# EAGLE design Adafruit Feather nRF52840 Sense Rev C (EAGLE 9.6.2)
COMPANY: ADAFRUIT INDUSTRIES; DRAWN: KTOWN; REV: D; YEAR: 2018
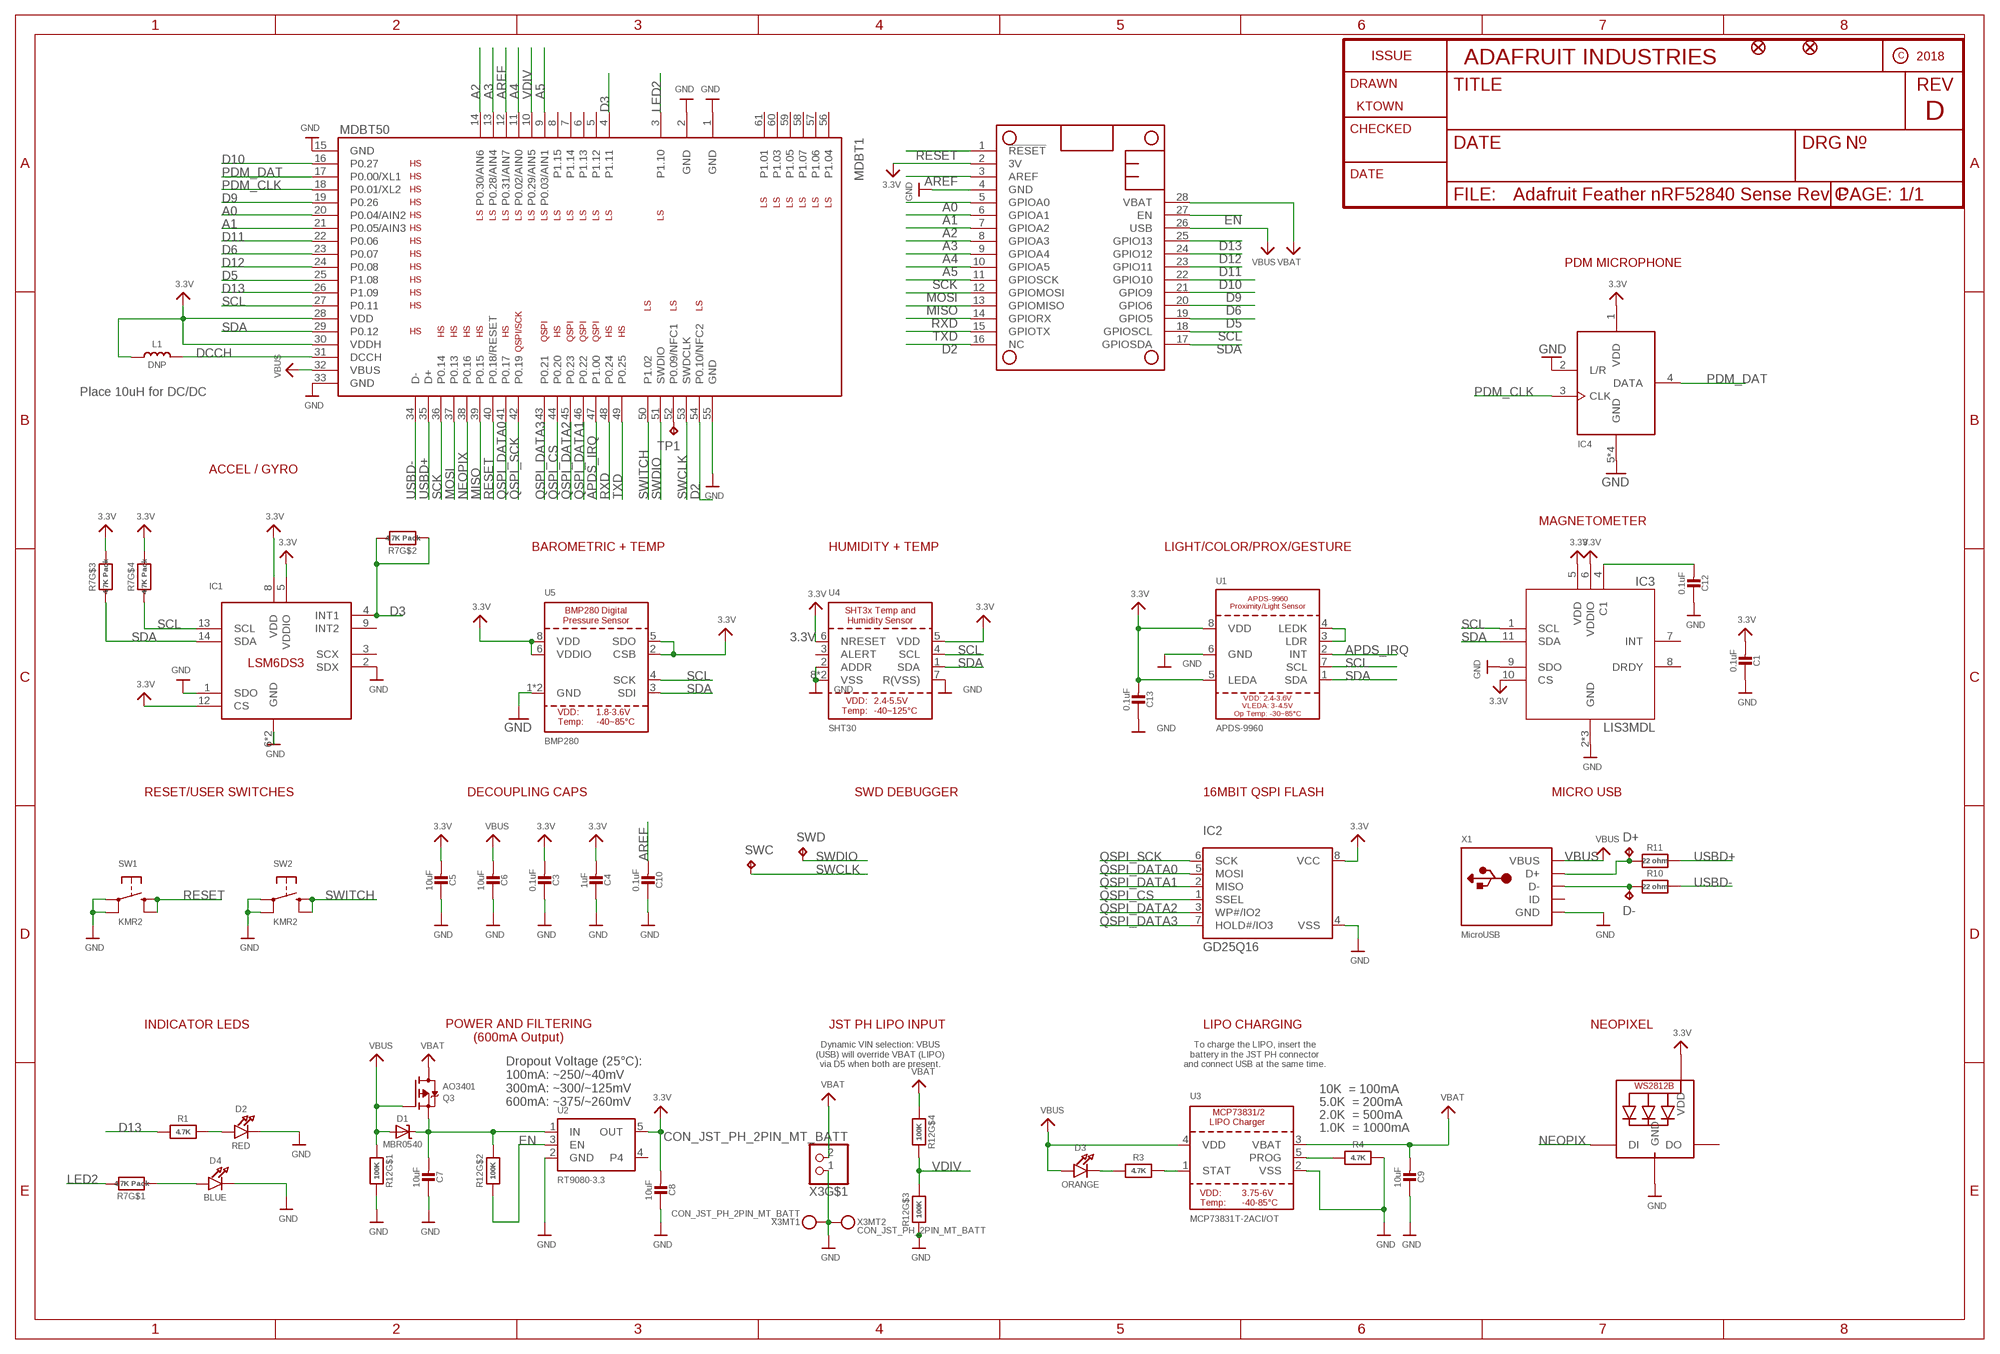
[diagram p0: schematic, sheet 1]

## Parts
C1  0.1uF  CAP_CERAMIC0603_NO  [0603-NO]
C3  0.1uF  CAP_CERAMIC0603_NO  [0603-NO]
C4  1uF  CAP_CERAMIC0603_NO  [0603-NO]
C5  10uF  CAP_CERAMIC0805-NOOUTLINE  [0805-NO]
C6  10uF  CAP_CERAMIC0805-NOOUTLINE  [0805-NO]
C7  10uF  CAP_CERAMIC0805-NOOUTLINE  [0805-NO]
C8  10uF  CAP_CERAMIC0805-NOOUTLINE  [0805-NO]
C9  10uF  CAP_CERAMIC0805-NOOUTLINE  [0805-NO]
C10  0.1uF  CAP_CERAMIC0603_NO  [0603-NO]
C12  0.1uF  CAP_CERAMIC0603_NO  [0603-NO]
C13  0.1uF  CAP_CERAMIC0603_NO  [0603-NO]
D1  MBR0540  DIODE-SCHOTTKYSOD-123  [SOD-123]
D2  RED  LED0603_NOOUTLINE  [CHIPLED_0603_NOOUTLINE]
D3  ORANGE  LED0603_NOOUTLINE  [CHIPLED_0603_NOOUTLINE]
D4  BLUE  LED0603_NOOUTLINE  [CHIPLED_0603_NOOUTLINE]
D+  TPTP10R  [TP10R]
D-  TPTP10R  [TP10R]
FID1  FIDUCIAL_1MM  [FIDUCIAL_1MM]
FID2  FIDUCIAL_1MM  [FIDUCIAL_1MM]
IC1  LSM6DS3  [LGA-14L]
IC2  GD25Q16  SPIFLASH_8PINUX  [USON8]
IC3  LIS3MDL  [LGA12_2X2MM]
IC4  MIC_PDM  MIC_PDM_SPK0415  [SPK0415HM4H]
L1  DNP  INDUCTOR_0805MP  [_0805MP]
LED1  WS2812B_3535FULL  [LED3535_FULLPADS]
MDBT1  MDBT50  [MDBT50]
MS1  FEATHERWING_NODIM  [FEATHERWING_NODIM]
Q3  AO3401  MOSFET-P  [SOT23-R]
R1  4.7K  RESISTOR_0603_NOOUT  [0603-NO]
R3  4.7K  RESISTOR_0603_NOOUT  [0603-NO]
R4  4.7K  RESISTOR_0603_NOOUT  [0603-NO]
R7  4.7K Pack  RESISTOR_4PACK  [RESPACK_4X0603]
R10  22 ohm  RESISTOR_0603_NOOUT  [0603-NO]
R11  22 ohm  RESISTOR_0603_NOOUT  [0603-NO]
R12  100K  RESISTOR_4PACK  [RESPACK_4X0603]
SW1  KMR2  SWITCH_TACT_SMT_RKB2  [BTN_RKB2_4.6X2.8]
SW2  KMR2  SWITCH_TACT_SMT_RKB2  [BTN_RKB2_4.6X2.8]
SWC  TPTP12R  [TP12R]
SWD  TPTP12R  [TP12R]
TP1  TPTP10R  [TP10R]
U1  APDS-9960  [APDS-9960]
U2  RT9080-3.3  VREG_SOT23-5  [SOT23-5]
U3  MCP73831T-2ACI/OT  MCP73831/2  [SOT23-5]
U4  SHT30  SHT3X  [SHT3X]
U5  BMP280  [BMP280]
X1  MicroUSB  USB_MICRO_20329_V2  [4UCONN_20329_V2]
X3  CON_JST_PH_2PIN_MT_BATT  [JSTPH2_BATT]

## Nets
3.3V [power]: C1.2 C3.2 C4.2 C5.2 C8.2 C13.2 IC1.5(VDDIO) IC1.8(VDD) IC1.12(CS) IC2.8(VCC) IC3.5(VDD) IC3.6(VDDIO) IC3.10(CS) IC4.1(VDD) L1.1 LED1.2(VDD) MDBT1.28(VDD) MDBT1.30(VDDH) MS1.2(3V) R7.5 R7.6 U1.5(LEDA) U1.8(VDD) U2.5(OUT) U4.5(VDD) U4.6(NRESET) U5.2(CSB) U5.5(SDO) U5.6(VDDIO) U5.8(VDD)
A0: MDBT1.20(P0.04/AIN2) MS1.5(GPIOA0)
A1: MDBT1.21(P0.05/AIN3) MS1.6(GPIOA1)
A2: MDBT1.14(P0.30/AIN6) MS1.7(GPIOA2)
A3: MDBT1.13(P0.28/AIN4) MS1.8(GPIOA3)
A4: MDBT1.11(P0.02/AIN0) MS1.9(GPIOA4)
A5: MDBT1.9(P0.03/AIN1) MS1.10(GPIOA5)
APDS_IRQ: MDBT1.47(P1.00) U1.2(INT)
AREF: C10.2 MDBT1.12(P0.31/AIN7) MS1.3(AREF)
CAP1: C12.2 IC3.4(C1)
D2: MDBT1.54(P0.10/NFC2) MS1.16(NC)
D3: IC1.4(INT1) MDBT1.4(P1.11) R7.2 R7.7
D5: MDBT1.25(P1.08) MS1.19(GPIO5)
D6: MDBT1.23(P0.07) MS1.20(GPIO6)
D9: MDBT1.19(P0.26) MS1.21(GPIO9)
D10: MDBT1.16(P0.27) MS1.22(GPIO10)
D11: MDBT1.22(P0.06) MS1.23(GPIO11)
D12: MDBT1.24(P0.08) MS1.24(GPIO12)
D13: MDBT1.26(P1.09) MS1.25(GPIO13) R1.1
D+: D+.TP R11.1 X1.D+
D-: D-.TP R10.1 X1.D-
DCCH: L1.2 MDBT1.31(DCCH)
EN: MS1.27(EN) R12.2 U2.3(EN)
GND: C1.1 C3.1 C4.1 C5.1 C6.1 C7.1 C8.1 C9.1 C10.1 C12.1 C13.1 D2.C D4.C IC1.1(SDO) IC1.2(SDX) IC1.6(GND) IC1.7(GND) IC2.4(VSS) IC3.2(GND) IC3.3(GND) IC3.9(SDO) IC3.12(GND) IC4.2(L/R) IC4.5(GND) IC4.6(GND) IC4.7(GND) IC4.8(GND) LED1.4(GND) MDBT1.1(GND) MDBT1.2(GND) MDBT1.15(GND) MDBT1.33(GND) MDBT1.55(GND) MS1.4(GND) R4.2 R12.3 R12.8 SW1.A'(P1) SW1.A(P) SW2.A'(P1) SW2.A(P) U1.6(GND) U2.2(GND) U3.2(VSS) U4.2(ADDR) U4.7(R(VSS)) U4.8(VSS) U4.THERMAL(VSS) U5.1(GND) U5.7(GND) X1.BASE@1(GND) X1.BASE@2(GND) X1.GND X1.SPRT@1(GND) X1.SPRT@2(GND) X1.SPRT@3(GND) X1.SPRT@4(GND) X3.1 X3.NC1 X3.NC2
LED2: MDBT1.3(P1.10) R7.8
MISO: MDBT1.39(P0.15) MS1.13(GPIOMISO)
MOSI: MDBT1.37(P0.13) MS1.12(GPIOMOSI)
N$1: D3.C R3.1
N$2: U1.3(LDR) U1.4(LEDK)
N$3: D4.A R7.1
N$5: D2.A R1.2
N$11: R3.2 U3.1(STAT)
N$12: R4.1 U3.5(PROG)
NEOPIX: LED1.1(DI) MDBT1.38(P0.16)
NFC2: MDBT1.52(P0.09/NFC1) TP1.TP
PDM_CLK: IC4.3(CLK) MDBT1.18(P0.01/XL2)
PDM_DAT: IC4.4(DATA) MDBT1.17(P0.00/XL1)
QSPI_CS: IC2.1(SSEL) MDBT1.44(P0.20)
QSPI_DATA0: IC2.5(MOSI) MDBT1.41(P0.17)
QSPI_DATA1: IC2.2(MISO) MDBT1.46(P0.22)
QSPI_DATA2: IC2.3(WP#/IO2) MDBT1.45(P0.23)
QSPI_DATA3: IC2.7(HOLD#/IO3) MDBT1.43(P0.21)
QSPI_SCK: IC2.6(SCK) MDBT1.42(P0.19)
RESET: MDBT1.40(P0.18/RESET) MS1.1(!RESET) SW1.B'(S1) SW1.B(S)
RXD: MDBT1.48(P0.24) MS1.14(GPIORX)
SCK: MDBT1.36(P0.14) MS1.11(GPIOSCK)
SCL: IC1.13(SCL) IC3.1(SCL) MDBT1.27(P0.11) MS1.18(GPIOSCL) R7.4 U1.7(SCL) U4.4(SCL) U5.4(SCK)
SDA: IC1.14(SDA) IC3.11(SDA) MDBT1.29(P0.12) MS1.17(GPIOSDA) R7.3 U1.1(SDA) U4.1(SDA) U5.3(SDI)
SWCLK: MDBT1.53(SWDCLK) SWC.TP
SWDIO: MDBT1.51(SWDIO) SWD.TP
SWITCH: MDBT1.50(P1.02) SW2.B'(S1) SW2.B(S)
TXD: MDBT1.49(P0.25) MS1.15(GPIOTX)
USBD+: MDBT1.35(D+) R11.2
USBD-: MDBT1.34(D-) R10.2
VBAT [power]: C9.2 MS1.28(VBAT) Q3.3(D) R12.4 U3.3(VBAT) X3.2
VBUS [power]: C6.2 D1.A D3.A MDBT1.32(VBUS) MS1.26(USB) Q3.1(G) R12.1 U3.4(VDD) X1.VBUS
VDIV: MDBT1.10(P0.29/AIN5) R12.5 R12.6
VHI [power]: C7.2 D1.C Q3.2(S) R12.7 U2.1(IN)
Unconnected: IC1.3(SCX) IC1.9(INT2) IC3.7(INT) IC3.8(DRDY) LED1.3(DO) MDBT1.5(P1.12) MDBT1.6(P1.13) MDBT1.7(P1.14) MDBT1.8(P1.15) MDBT1.56(P1.04) MDBT1.57(P1.06) MDBT1.58(P1.07) MDBT1.59(P1.05) MDBT1.60(P1.03) MDBT1.61(P1.01) U2.4 U4.3(ALERT) X1.ID

## Notes on the sheet
- PDM MICROPHONE
- Place 10uH for DC/DC
- ACCEL / GYRO
- MAGNETOMETER
- BAROMETRIC + TEMP | HUMIDITY + TEMP | LIGHT/COLOR/PROX/GESTURE
- RESET/USER SWITCHES | DECOUPLING CAPS | SWD DEBUGGER | 16MBIT QSPI FLASH | MICRO USB
- INDICATOR LEDS | JST PH LIPO INPUT | LIPO CHARGING | NEOPIXEL
- POWER AND FILTERING
  (600mA Output)
- Dynamic VIN selection: VBUS
  (USB) will override VBAT (LIPO)
  via D5 when both are present.
- To charge the LIPO, insert the
  battery in the JST PH connector
  and connect USB at the same time.
- 10K  = 100mA
- Dropout Voltage (25°C):
  100mA: ~250/~40mV
  300mA: ~300/~125mV
  600mA: ~375/~260mV
- 5.0K  = 200mA
- 2.0K  = 500mA
- 1.0K  = 1000mA

## Library data of the parts
C1 C3-C10 C12 C13 = microbuilder:CAP_CERAMIC: Ceramic Capacitors For new designs, use the packages preceded by an '_' character since they are more reliable: The following footprints should be used on most boards: _0402 - Standard footprint for regular board layouts _0603 - Standard footprint for regular board layouts _0805 - Standard footprint for regular board layouts _1206 - Standard footprint for regular board layouts For extremely tight-pitch boards where space is at a premium, the following 'micro-pitch' footprints can be used (smaller pads, no silkscreen outline, etc.): _0402MP - Micro-pitch footprint for very dense/compact boards _0603MP - Micro-pitch footprint for very dense/compact boards _0805MP - Micro-pitch footprint for very dense/compact boards _1206MP - Micro-pitch footprint for very dense/compact boards
D1 = microbuilder:DIODE-SCHOTTKY
D2-D4 = microbuilder:LED: LED 0603 - 0603 Surface Mount Package 2mA: Green LED - Low Power (3.9mcd, 2ma, 1.7Vf) - Digikey: 475-2709-2-ND Orange LED - Low Power (9.8mcd, 2ma, 1.8Vf) - Digikey: 475-1194-2-ND Red LED - Low Power (5mcd, 2ma, 1.8Vf) - Digikey: 475-1195-2-ND Yellow LED - Low Power (7mcd, 2ma, 1.8Vf) - Digikey: 475-1196-2-ND 5mA: Blue LED - Low Power (17mcd, 5ma, 2.9Vf) - Digikey: LNJ937W8CRACT-ND 0805 - 0805 Surface Mount Package 2mA: Red LED (8.8mcd, 2mA, 1.8Vf, Clear) - Low Power [Digikey: 475-2510-1-ND] Green LED (5mcd, 2mA, 1.8Vf, Clear) - Low Power [Digikey: 475-2730-1-ND] Yellow LED (11.3mcd, 2mA, 1.8Vf, Clear) - Low Power [Digikey: 475-2555-1-ND] 20mA: Red LED (104mcd, 20mA, Diffused) - LS R976 [Digikey: 475-1278-6-ND] Red LED (12mcd, 20mA, 2.0Vf, Clear) - APT2012EC [Digikey: 754-1128-1-ND] Green LED (15mcd, 20mA, 2.2Vf, Clear) - APT2012GC [Digikey: 754-1131-1-ND] Orange LED (160mcd, 20mA, 2.1Vf, Clear) - APT2012SECK [Digikey: 754-1130-1-ND] 1206 - 1206 Surface Mount Package Green LED (26mcd, 20mA, Diffused) - LG N971 [Digikey: 475-1407-6-ND] Red LED (15mcd, 20mA, Diffused) - LH N974 [Digikey: 475-1416-6-ND] Cree - Cree High-Power Surface Mount LEDs XPEBWT-L1-0000-00D50 - White 111lm 350mA 2.9Vf 6200K 110° XTEAWT-00-0000-00000LEE3 - White 114lm 350mA 2.85Vf 5000K 115° Everlight - Everlight 45-21 Series Surface Mount LEDs 45-21/QK2C-B2832AC2CB2/2T - Warm White 2000mcd 20mA 3.25Vf 3050K 120° 45-21/LK2C-B38452C4CB2/2T - Nuetral White 2000mcd 20mA 3.25Vf 4150K 120° 45-21/LK2C-B50634C6CB2/2T - Cold White 2200mcd 20mA 3.25Vf 5650K 120° PLCC2 Reverse Mount LS T77K-J1L2-1-0-2-R18-Z - Red 11.25mcd 2mA 1.8Vf 630nm 120° LO T77K-L1M2-24-Z - Orange 19.6mcd 2mA 1.8Vf 606nm 120° LY T77K-K2M1-26-Z - Yellow 15.7mcd 2mA 1.8Vf 587nm 120°; ROT: 270
D+ D- SWC SWD TP1 = testpad:TP: Test pad
FID1 FID2 = microbuilder:FIDUCIAL: Fiducial Alignment Points Various fiducial points for machine vision alignment.; BOM: EXCLUDE
IC1 = adafruit_sensor:LSM6DS3
IC2 = microbuilder:SPIFLASH_8PIN: SOIC8 SPI Flash Be careful with the size since SOIC8 flash comes in several 'widths' SOIC8 150 mil M25P16 - 16Mbit (2Mbit x 8) Serial Flash (75MHz SPI Bus), Supply: 2.7-3.6V Digikey: SOIC8 - M25P16-VMN6P-ND SOIC8 208 mil W25Q16BVSSIG - 16Mbit (2Mbit x 8) Serial Flash (104MHz SPI Bus), Supply: 2.7-3.6V Digikey: SOIC8 - W25Q16BVSSIG-ND
IC3 = adafruit_sensor:LIS3MDL: Digital output magnetic sensor. ultra-low-power, high-performance 3-axis magnetometer; ROT: 270
IC4 = microbuilder:MIC_PDM
L1 = microbuilder:INDUCTOR: Inductors 0603: 10nH Ceramic Inductor - microwire antenna/RF (Digikey: 712-1434-2-ND) 0805: 560nH Ceramic Inductor - RF (Digikey: 553-1047-1-ND) 270nH Ceramic Inductor - Q = 40@250MHz, +-5%, 1 Ohm DC Resistance (Digikey: 535-10506-2-ND) 1007 (2518 Metric) SMT: 10µH 10% 250mOhm 820mA 1007 Inductor (Digikey: 587-2189-1-ND) 22µH 10% 500mOhm 580mA 1007 Inductor (Digikey: 587-2190-1-ND) 47µH 10% 950mOhm 420mA 1007 Inductor (Digikey: 587-2191-1-ND) 47µH 5% 100mOhm 1A 1008 Inductor (Digikey: 732-1816-1-ND) 5.0x5.0mm (Taiyo Yuden NR5040 Series) 6.8µH 20% 2.3A 64mOhm Inductor (Digikey: 587-2374-2-ND) 5.0x5.0mm (TDK VLC5045 Series) 4.7µH 20% 3.3A 34mOhm Inductor (Digikey: 445-6526-1-ND) 6.8µH 20% 2.7A 46mOhm Inductor (Digikey: 445-6527-1-ND) 6.0x6.0mm (TDK VLC6045 Series) 4.7µH 20% 3.8A 27mOhm Inductor (Digikey: 445-6538-2-ND) 6.8µH 20% 3A 41mOhm Inductor (Digikey: 445-6540-1-ND) 6.2µH 30% 2.2A 45mOhm Inductor (Digikey: SRR5028-6R2YCT-ND) - Not TDK VLC6045 but footprint should match 6.0x6.0mm (TDK SLF6045 Series) 6.8uH 30% 2A 33mOhm Inductor (Digikey: 445-4572-1-ND, Mouser: 810-SLF645T6R8N2R0PF) 6.0x6.0mm (Sumida CDRH5D28 Series) 6.2uH 30% 1.8A 45mOhm Inductor (Digikey: 308-1542-1-ND) Taiyo Yuden NR3015T2R2M - 2.2uH 20% 1.5A (Digikey: 587-1648-2-ND, Mouser: 963-NR3015T2R2M) - Used with TI TPS62172 CoilCraft RFID Transponder Coil - MA5532-AE (For use with AS3935 Lightning Sensor) Taiyo Yuden NRH2412T2R2MNGH - 2.2uH 20% 1AA (Digikey: 587-3443-1-ND) - Used with TI LM3671 Vishay IHLP 1.0uH Molded Inductor - 24mOhm DCR, 5A, +/-20%, -55°C-125°C (Digikey: 541-1319-1-ND)
LED1 = microbuilder:WS2812B; ROT: 180
MDBT1 = microbuilder:MDBT50: Raytac Corporation MDBT50 Bluetooth Low Energy Module based on Noridc nRF52840 Source: Raytac datasheet
MS1 = microbuilder:FEATHERWING
Q3 = microbuilder:MOSFET-P: P-Channel Mosfet LEGEND VDS: Voltage Drain-Source ID: Drain Current RDS(ON): Drain-Source On-State Resistance VGS(TH): Gate-Source Threshold Voltage CISS: Drain-Source Input Capacitance SOT-23 Name VDS ID RDS(ON) VGS(TH) CISS Order Number IRLML5103 30V 760mA 600 mOhm -- 75pF @ 25V Digikey: IRLML5103PBFCT-ND IRLML6401 12V 4.3A 50 mOhm 950mV @ 250µA 830pF @ 10V Digikey: IRLML6401PBFTR-ND NTR0202PL 20V 400mA 800 mOhm 2.3V @ 250uA 70pF @ 5V Digikey: NTR0202PLT1GOSTR-ND NTR4101PT1G 20V 1.8A 85 mOhm 1.2V @ 250uA 675pF @ 10V Digikey: NTR4101PT1GOSCT-ND DMP2004K 20V 600mA 900 mOhm 1V @ 250uA 175pF @ 16V Digikey: DMP2004KDICT-ND PMV65XP 20V 3.9A 76 mOhm 950mV @ 1mA 725pF @ 20V Digikey: 568-2358-2-ND TO-252 Name VDS ID RDS(ON) VGS(TH) CISS Order Number AOD417 30V 25A 34 mOhm 3V @ 250µA 920pF @ 15V Digikey: 785-1106-2-ND PowerPak Name VDS ID RDS(ON) VGS(TH) CISS Order Number AON7401 30V 12A 14 mOhm 3V @ 250µA 2600pF @ 15V Digikey: 785-1302-1-ND
R1 R3 R4 R10 R11 = microbuilder:RESISTOR: Resistors For new designs, use the packages preceded by an '_' character since they are more reliable: The following footprints should be used on most boards: _0402 - Standard footprint for regular board layouts _0603 - Standard footprint for regular board layouts _0805 - Standard footprint for regular board layouts _1206 - Standard footprint for regular board layouts For extremely tight-pitch boards where space is at a premium, the following 'micro-pitch' footprints can be used (smaller pads, no silkscreen outline, etc.): _0402MP - Micro-pitch footprint for very dense/compact boards _0603MP - Micro-pitch footprint for very dense/compact boards _0805MP - Micro-pitch footprint for very dense/compact boards _1206MP - Micro-pitch footprint for very dense/compact boards
R7 R12 = microbuilder:RESISTOR_4PACK: Resistor Packs (4 resistors) 4 x 0603 10K 1/16W - Digikey: YC164J-10KCT-ND
SW1 SW2 = adafruit_electromech:SWITCH_TACT_SMT: SMT Tact Switches RKB2 https://www.digikey.com/short/m027prz5
U1 = adafruit_sensor:APDS-9960: APDS-9960 - Digital Proximity Sensor with Ambient Light/RGB/Gesture Detection
U2 = adafruit_power:VREG_SOT23-5: SOT23-5 Fixed Voltage Regulators Part Current Out V Out V In V Dropout θJA (°C/W) TJ (°C) Digikey Part No. ADP121 150mA 3.3V 3.4-5.5V 0.09V @ 150mA -- -- ADP121-AUJZ33R7CT-ND ADP121 150mA 3.0V 3.1-5.5V 0.09V @ 150mA -- -- ADP121-AUJZ30R7CT-ND ADP122 300mA 3.3V 3.4-5.5V 0.085V @ 300mA -- -- ADP122AUJZ-3.3-R7CT-ND ADP1712 300mA 3.3V 3.5-5.5V 0.17V @ 300mA -- -- ADP1712AUJZ-3.3-R7TR-ND AP7311 (Low Cost) 150mA 3.3V 3.5-6V 0.15V @ 150mA -- -- AP7311-33WG-7DICT-ND LD39015M18R 150mA 1.8V 1.9V-5.5V 0.08V @ 100mA -- -- 497-6977-1-ND LP2985A-33DBVR 150mA 3.3V 3.3-16V 0.28V @ 150mA 206 150 296-18479-1-ND MCP1824T-3302E/OT 300mA 3.3V 3.5V-6V 0.2V @ 300mA -- -- MCP1824T-3302E/OTCT-ND MIC5205-2.5YM5 TR 150mA 2.5V 2.7-16V 0.165V @ 150mA -- -- 576-1257-2-ND MIC5205-3.0YM5 TR 150mA 3.0V 3.2V-16V 0.165V @ 150mA -- -- 576-1258-2-ND MIC5205-3.3YM5 TR 150mA 3.3V 3.5V-16V 0.165V @ 150mA -- -- 576-1259-2-ND TPS780330220 150mA 3.3V+2.2V 3.6-5.5V 250mV Max -- -- 296-23332-1-ND TDA3663/N1,135 100mA 3.3V 3.5-45V 0.18V @ 50mA -- -- 568-5343-1-ND Max operating temp can be calculated using θJA, TJ (max junction temperature), and power in watts. Set the "Maximum Ambient Temperature" until it reaches TJ ("Max Junction Temperature"), which is the absolute limit for safe use of the regulator: Heat Sink Temperature Calculator <http://www.daycounter.com/Calculators/Heat-Sink-Temperature-Calculator.phtml> For example, With 12V source into a 3.3V LP2985 and a 30mA load, we are dissipating (12V-3.3V) * 0.03A = 0.261W. With a θJA of 206 °C/W, a TJ of 150°C, and 261mW we can safely use the chip without a heat sink up to 75°C (=147.1°C Junction Temperature).; JLC_ROTATION: 0
U3 = microbuilder:MCP73831/2: MCP73831/2 LIPO Charger VDD: 3.75 - 6V Temp -40 - 85°C Programmable Charge Rate: 15-500mA NOTE: STAT is a tri-state logic output on the MCP73831 and an open-drain output on the MCP73832. SOT23-5 with 4.2V output and tri-state logic on STAT = MCP73831T-2ACI/OT; JLC_ROTATION: 0; LCSC: C424093
U4 = adafruit_sensor:SHT3X: SHT3x - Digital Temperature and Humidity Sensor Supply Voltage: 2.4-5.5V Humidity Accuracy: SHT30 = +/-3%RH, SHT31 = +/-2%RH Temperature Sensor: -40~125°C (+/-0.3°C from 10-55C)
U5 = adafruit_sensor:BMP280: BMP280 - Digital Pressure Sensor Operating Pressure Range: 300-1100 hPa Pressure Resolution: 0.16Pa RMS Noise: 1.3Pa Temperature Resolution: 0.01 C
X1 = adafruit_electromech:USB: USB Connectors USBMINIB - Surface Mount Female Mini-B USB Connector 4UConnector: 06564
X3 = adafruit_electromech:CON_JST_PH_2PIN_MT; LCSC: C47647

## Net classes
1 power: width 0.254 mm

## Board
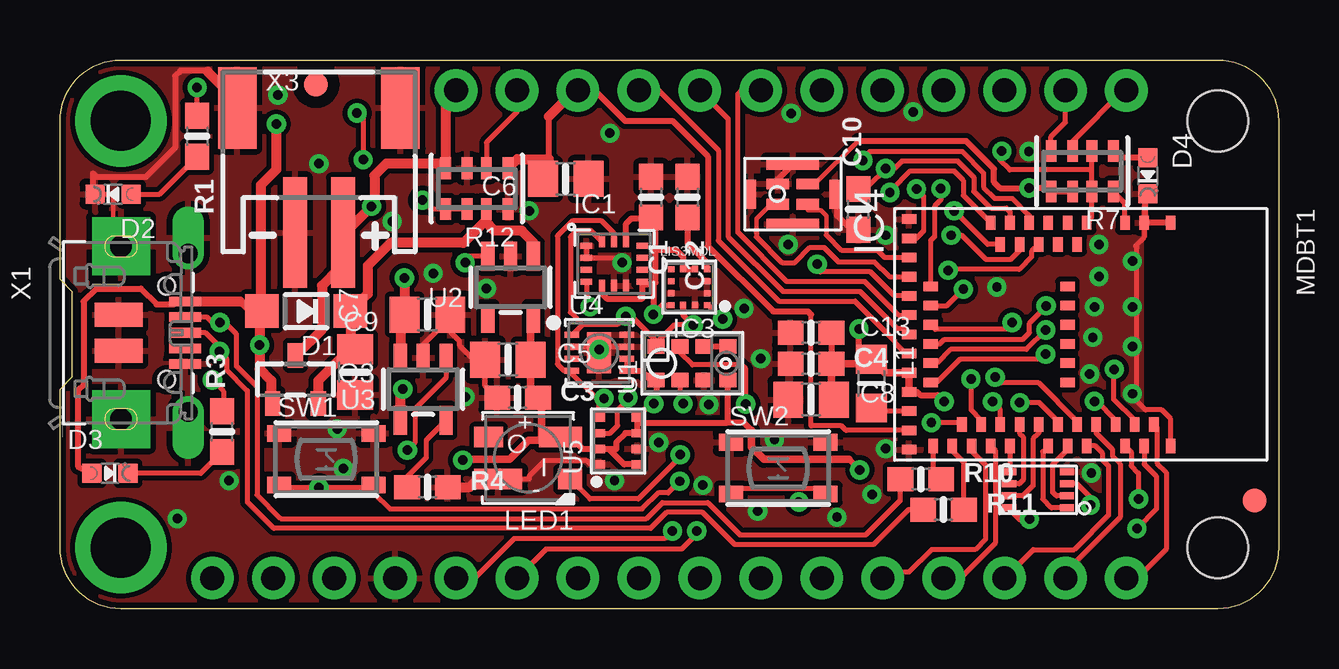
[diagram p1: board, top side]
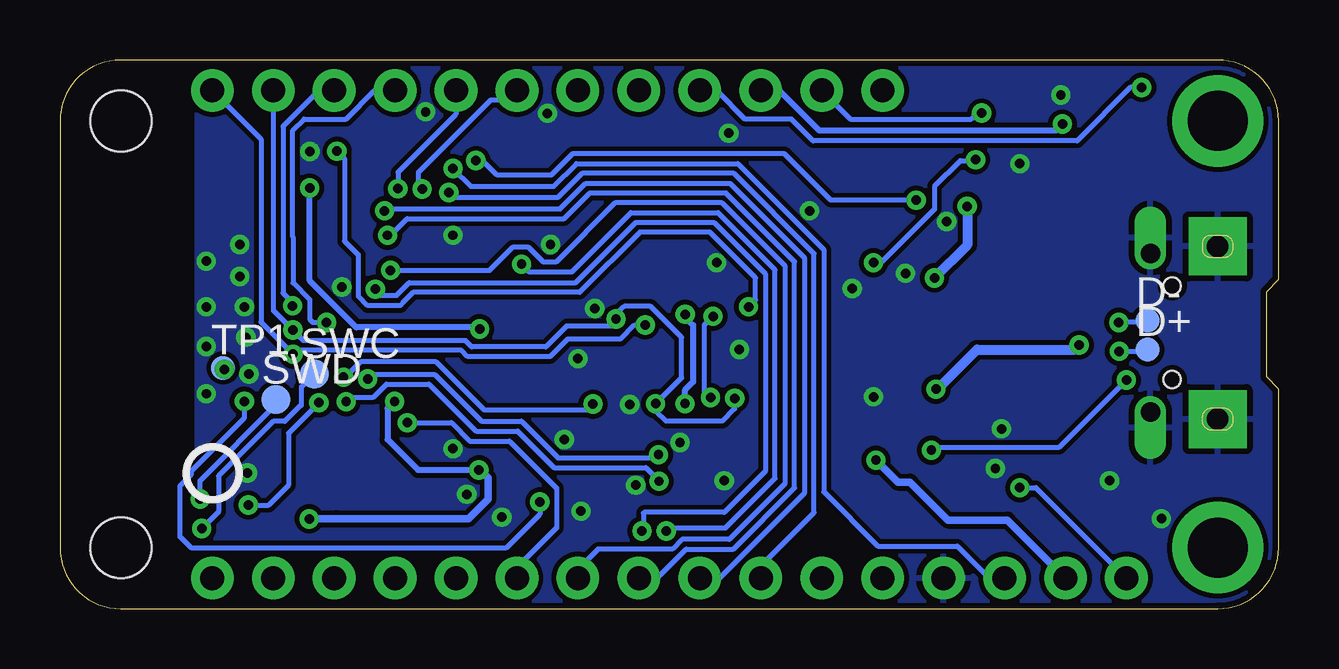
[diagram p2: board, bottom side, seen from below]

Size 50.8 x 22.86 mm. Coordinates in mm from the lower left corner, seen from the top.
Outline: 2.54,22.86 48.26,22.86 arc-90 50.8,20.32 50.8,2.54 arc-90 48.26,0 2.54,0 arc-90 0,2.54 0,9.14 0.51,9.65 0.51,13.21 0,13.72 0,20.32 arc-90 2.54,22.86
Copper layers (1*16): Top 0.035mm / dielectric 1.5mm / Bottom 0.035mm
Design rules "adafruit 7-7": minimum track width 7mil, minimum drill 15.5mil, track to track 8mil, track to pad 7mil, pad to pad 7mil, via to via 7mil, smd to smd 7mil, copper to edge 10mil, drill to drill 8mil, minimum pad ring 10mil, minimum via ring 8mil, stop-mask expansion 2mil, vias tented up to drill 20mil, thermal gap 10mil

### Footprints (pad centres in the part's own frame; a part is rotated, then mirrored left to right if it is on the bottom)
0603-NO = smd 1.075 x 1: 1 -0.85,0; 2 0.85,0
0805-NO = smd 1.24 x 1.5: 1 -0.95,0; 2 0.95,0
SOD-123 = smd 1.4 x 1.4: A 1.85,0; C -1.85,0
CHIPLED_0603_NOOUTLINE = smd 0.8 x 0.8: A 0,-0.75; C 0,0.75
TP10R = smd 1 x 1: TP 0,0
FIDUCIAL_1MM = smd 1 x 1: 1 0,0
LGA-14L = smd 0.475 x 0.25: 1 -1.163,0.75; 2 -1.163,0.25; 3 -1.163,-0.25; 4 -1.163,-0.75; 8 1.163,-0.75; 9 1.163,-0.25; 10 1.163,0.25; 11 1.163,0.75 | smd 0.25 x 0.475: 5 -0.5,-0.912; 6 0,-0.912; 7 0.5,-0.912; 12 0.5,0.912; 13 0,0.912; 14 -0.5,0.912
USON8 = smd 0.6 x 0.275: 1 -1.2,0.75; 2 -1.2,0.25; 3 -1.2,-0.25; 4 -1.2,-0.75; 5 1.2,-0.75; 6 1.2,-0.25; 7 1.2,0.25; 8 1.2,0.75
LGA12_2X2MM = smd 0.275 x 0.25: 1 -0.75,0.75; 2 -0.75,0.25; 3 -0.75,-0.25; 4 -0.75,-0.75; 7 0.75,-0.75; 8 0.75,-0.25; 9 0.75,0.25; 10 0.75,0.75 | smd 0.25 x 0.275: 5 -0.25,-0.75; 6 0.25,-0.75; 11 0.25,0.75; 12 -0.25,0.75
SPK0415HM4H = smd 0.45 x 0.95: 1 0.425,-0.625; 2 0.425,0.625; 3 -0.425,0.625; 4 -0.425,-0.625 | smd 1.2 x 0.45: 5 0,-1.75; 7 0,1.75 | smd 0.45 x 2.2: 6 1.25,0; 8 -1.25,0
_0805MP = smd 1.2 x 1.3: 1 -1.016,0; 2 1.016,0
LED3535_FULLPADS = smd 1 x 0.85: 1 -1.75,0.875 | smd 1.8 x 0.85: 2 -1.35,-0.875 | smd 1.2 x 0.85: 3 1.65,-0.875 | smd 2 x 0.85: 4 1.25,0.875
MDBT50 = smd 0.6 x 0.4: 1 -4.65,3.75; 2 -4.65,2.65; 3 -4.65,1.85; 4 -4.65,0.25; 5 -3.75,-0.15; 6 -4.65,-0.55; 7 -3.75,-0.95; 8 -4.65,-1.35; 9 -3.75,-1.75; 10 -4.65,-2.15; 11 -3.75,-2.55; 12 -4.65,-2.95; 13 -3.75,-3.35; 14 -4.65,-3.75; 34 4.65,-6.15; 35 4.65,-5.35; 36 3.75,-4.95; 37 4.65,-4.55; 38 3.75,-4.15; 39 4.65,-3.75; 40 3.75,-3.35; 41 4.65,-2.95; 42 3.75,-2.55; 43 3.75,-1.75; 44 4.65,-1.35; 45 3.75,-0.95; 46 4.65,-0.55; 47 3.75,-0.15; 48 4.65,0.25; 49 3.75,0.65; 50 3.75,1.45; 51 4.65,1.85; 52 3.75,2.25; 53 4.65,2.65; 54 3.75,3.05; 55 4.65,3.75 | smd 0.4 x 0.6: 15 -4.8,-7.15; 16 -4,-7.15; 17 -3.2,-7.15; 18 -2.4,-7.15; 19 -2,-6.25; 20 -1.6,-7.15; 21 -1.2,-6.25; 22 -0.8,-7.15; 23 -0.4,-6.25; 24 0,-7.15; 25 0.4,-6.25; 26 0.8,-7.15; 27 1.2,-6.25; 28 1.6,-7.15; 29 2,-6.25; 30 2.4,-7.15; 31 3.2,-7.15; 32 4,-7.15; 33 4.8,-7.15; 56 -2,-0.55; 57 -1.2,-0.55; 58 -0.4,-0.55; 59 0.4,-0.55; 60 1.2,-0.55; 61 2,-0.55
FEATHERWING_NODIM = drill 1 pad 1.778: 1 6.35,1.27; 2 8.89,1.27; 3 11.43,1.27; 4 13.97,1.27; 5 16.51,1.27; 6 19.05,1.27; 7 21.59,1.27; 8 24.13,1.27; 9 26.67,1.27; 10 29.21,1.27; 11 31.75,1.27; 12 34.29,1.27; 13 36.83,1.27; 14 39.37,1.27; 15 41.91,1.27; 16 44.45,1.27; 17 44.45,21.59; 18 41.91,21.59; 19 39.37,21.59; 20 36.83,21.59; 21 34.29,21.59; 22 31.75,21.59; 23 29.21,21.59; 24 26.67,21.59; 25 24.13,21.59; 26 21.59,21.59; 27 19.05,21.59; 28 16.51,21.59 | drill 2.5 pad 3.81: P$1 2.54,20.32; P$2 2.54,2.54 | hole 2.54: 48.26,20.32; 48.26,2.54
SOT23-R = smd 0.635 x 1.016: 1 -0.95,-1; 2 0.95,-1; 3 0,1
RESPACK_4X0603 = smd 0.45 x 0.9: 1 -1.3,-0.85; 2 -0.4,-0.85; 3 0.4,-0.85; 4 1.3,-0.85; 5 1.3,0.85; 6 0.4,0.85; 7 -0.4,0.85; 8 -1.3,0.85
BTN_RKB2_4.6X2.8 = smd 1 x 0.7: A 1.973,1.075; A' -1.973,1.075; B 1.973,-1.075; B' -1.973,-1.075
TP12R = smd 1.2 x 1.2: TP 0,0
APDS-9960 = smd 0.6 x 0.72: 1 0.7,1.505; 2 0.7,0.505; 3 0.7,-0.495; 4 0.7,-1.495; 5 -0.7,-1.495; 6 -0.7,-0.495; 7 -0.7,0.505; 8 -0.7,1.505
SOT23-5 = smd 0.55 x 1.2: 1 -0.95,-1.3; 2 0,-1.3; 3 0.95,-1.3; 4 0.95,1.3; 5 -0.95,1.3
SHT3X = smd 0.6 x 0.25: 1 -1.15,0.75; 2 -1.15,0.25; 3 -1.15,-0.25; 4 -1.15,-0.75; 5 1.15,-0.75; 6 1.15,-0.25; 7 1.15,0.25; 8 1.15,0.75 | smd 1 x 1.7: THERMAL 0,0
BMP280 = smd 0.5 x 0.35: 1 0.8,0.975; 2 0.8,0.325; 3 0.8,-0.325; 4 0.8,-0.975; 5 -0.8,-0.975; 6 -0.8,-0.325; 7 -0.8,0.325; 8 -0.8,0.975
4UCONN_20329_V2 = smd 1 x 2: BASE@1 -0.75,-1.365; BASE@2 0.75,-1.365 | smd 0.4 x 1.35: D+ 0,1.41; D- -0.65,1.41; GND 1.3,1.41; ID 0.65,1.41; VBUS -1.3,1.41 | drill 0.8 pad 1.143 offset: SPRT@1 -3.3,1.535; SPRT@2 3.3,1.535 | drill 0.9 pad 2.413 square: SPRT@3 -3.6,-1.265; SPRT@4 3.6,-1.265 | hole 0.7: -1.95,0.635; 1.95,0.635
JSTPH2_BATT = smd 1 x 4.6: 1 -1,-2.303; 2 1,-2.303 | smd 1.6 x 3.4: NC1 -3.4,2.897; NC2 3.4,2.897

### Placement (x,y rotation side)
C1  24.64,17.14 270 top
C3  19.08,8.79 0 top
C4  31.31,10.2 0 top
C5  18.67,10.38 0 top
C6  21.08,17.91 180 top
C7  12.29,9.86 90 top
C8  31.31,8.71 0 top
C9  15.32,12.26 180 top
C10  33.27,16.64 90 top
C12  26.16,17.14 270 top
C13  31.31,11.49 0 top
D1  10.26,12.4 180 top
D2  2.22,17.27 90 top
D3  2.08,5.64 270 top
D4  45.34,18.03 180 top
D+  5.46,10.79 0 bottom
D-  5.46,12 0 bottom
FID1  10.67,21.84 0 top
FID2  49.78,4.51 0 top
IC1  23.1,14.38 0 top
IC2  40.77,4.95 180 top
IC3  26.23,13.4 180 top
IC4  30.54,17.27 90 top
L1  33.82,9.37 270 top
LED1  19.51,6.27 180 top
MDBT1  42.55,11.43 270 top
MS1  0,0 0 top
Q3  9.82,9.55 0 top
R1  5.71,19.68 270 top
R3  6.76,7.38 90 top
R4  15.32,5.07 0 top
R7  42.61,18.22 180 top
R10  35.88,5.4 0 top
R11  36.83,4.13 0 top
R12  17.37,17.5 180 top
SW1  11.1,6.22 0 top
SW2  29.93,5.85 0 top
SWC  40.2,9.78 0 bottom
SWD  41.81,8.71 0 bottom
TP1  44.01,10.03 0 bottom
U1  26.35,10.22 90 top
U2  18.78,13.39 180 top
U3  15.14,9.14 180 top
U4  22.48,10.67 0 top
U5  23.27,6.99 180 top
U$10  [PCBFEAT-REV-056]  44.43,5.64 0 bottom
U$14  [FEATHERSENSE_TOP]  0,0 0 top
U$75  [FEATHERSENSE_BOT]  50.8,0 0 bottom
X1  3.81,11.49 270 top
X3  10.79,17.97 0 top

### Tracks (layer width: path | path; a pad name or v marks a point on that pad's centre or on a via)
3.3V  (via drill 0.39)
  Top 0.178: IC4.1 31.48,17.7 33.26,19.48
  Top 0.254: 32.89,6.22 v33.34,5.78 | LED1.2 21.3,7.15 21.79,6.66 U5.2 22.87,6.66 | 22.87,6.66 23.18,6.66 23.18,6.93 23.57,7.31 U5.6 24.07,7.75 | U5.8 23.52,6.01 22.87,6.66 | 24.07,7.75 U5.5 24.07,7.99 24.62,8.54 | 24.62,8.54 24.75,8.67 24.86,8.67 24.86,9.46 | U1.8 24.86,9.46 | 24.86,9.46 24.66,9.46 24.66,9.5 24.25,9.92 U4.5 U4.6 | IC3.10 25.12,12.65 v24.74,12.26 24.74,13.53 | 24.83,14.94 25.69,14.94 25.98,14.66 IC3.6 IC3.5 | R7.6 R7.5 41.16,17.52 v40.39,17.52 39.18,17.52 38.93,17.77 38.93,18.33 37.78,19.48 33.26,19.48 | 24.62,8.54 v24.75,8.54 | L1.1 33.31,10.9 v33.31,11.65 | 24.07,7.75 27.81,7.75 | 28.83,7.43 28.51,7.75 27.81,7.75 | U1.5 27.81,9.49 27.81,7.75 | C13.2 C4.2 | 24.6,16.26 C1.2 | MDBT1.30 35.73,9.03 35.86,8.9 36.59,8.9 v36.85,8.63 | IC1.5 22.6,13.11 22.79,12.92 24.26,12.92 IC1.8 24.36,13.53 24.74,13.53 | 24.83,14.94 24.83,13.59 24.74,13.59 24.74,13.53 | IC1.12 23.6,16.05 23.81,16.26 24.6,16.26 | 24.83,14.94 24.83,16.03 24.6,16.26
  Top 0.305: U2.5 19.62,11.97 C5.2 19.62,9.1 C3.2 20.07,8.65 20.07,7.15 | MDBT1.30 MDBT1.28 34.38,9.83 L1.1 33.63,10.2 C4.2 32.16,8.81 C8.2 | 32.89,6.22 29.34,6.22 28.83,6.73 28.83,7.43 | v16.79,6.18 16.79,6.22 18.73,6.22 19.53,7.02 20.07,7.02 20.07,7.15 | IC2.8 40.03,3.74 v40.41,3.74 | 20.07,7.15 LED1.2
  Bottom 0.254: v24.75,8.54 24.75,9.11 24.41,9.45 24.41,11.81 24.74,12.13 v24.74,12.26 | v33.31,11.65 33.38,11.72 38.45,11.72 40.39,13.66 v40.39,17.52 | v36.85,8.63 37.15,8.34 37.15,7.05 35.88,5.78 v33.34,5.78
  Bottom 0.305: v40.41,3.74 39.28,3.74 39.27,3.75 33.76,3.75 32.96,4.55 32.96,5.46 33.27,5.78 v33.34,5.78 | MS1.2 11.3,3.68 13.78,3.68 15.37,5.27 15.88,5.27 v16.79,6.18
A0  (via drill 0.39)
  Top 0.203: MDBT1.20 34.79,13.03 33.78,14.03 31.69,14.03 31.56,14.16 v31.56,14.35 | v25.53,3.24 25.21,2.92 18.92,2.92 17.27,1.27 MS1.5
  Bottom 0.203: v31.56,14.35 31.24,14.03 29.46,14.03 27,16.5 23.37,16.5 20.99,14.12 20.99,5.42 23.05,3.37 25.27,3.37 25.4,3.24 v25.53,3.24
A1  (via drill 0.39)
  Top 0.203: MDBT1.21 36.98,12.63 v37.66,13.31 | MS1.6 20.26,2.48 25.91,2.48 26.48,3.05 26.48,3.17 v26.54,3.24
  Bottom 0.203: v26.54,3.24 26.48,3.24 26.48,3.98 26.45,4.01 23.11,4.01 21.4,5.72 21.4,13.95 23.54,16.09 26.8,16.09 29.3,13.58 36.24,13.58 36.77,13.06 37.4,13.06 v37.66,13.31
A2  (via drill 0.39)
  Top 0.203: v34.59,17.34 34.67,17.34 34.67,17.46 35.45,18.24 37.26,18.24 37.66,17.84 37.66,17.22 MDBT1.14
  Bottom 0.203: v34.59,17.34 v34.58,17.34 34.38,17.13 30.05,17.13 29.05,18.14 22.71,18.14 19.37,14.79 19.37,4 21.59,1.78 MS1.7
A3  (via drill 0.39)
  Top 0.203: MDBT1.13 38.67,15.18 v37.27,16.57
  Bottom 0.203: v37.27,16.57 37.19,16.66 29.95,16.66 28.89,17.72 22.87,17.72 19.77,14.62 19.77,4.8 23.3,1.27 MS1.8
A4  (via drill 0.39)
  Top 0.203: MDBT1.11 39.99,14.91 39.62,14.54 38.61,14.54 37.59,15.56 v37.15,15.56
  Bottom 0.203: v37.15,15.56 37.02,15.56 36.32,16.25 29.78,16.25 28.72,17.31 23.04,17.31 20.18,14.46 20.18,5.03 22.73,2.48 24.7,2.48 25.91,1.27 MS1.9
A5  (via drill 0.39)
  Top 0.203: MDBT1.9 40.5,14.88 40.5,14.65 39.98,14.13 37.06,14.13 v37.02,14.1
  Bottom 0.203: MS1.10 29.21,1.65 28.38,2.48 25.27,2.48 24.87,2.88 22.9,2.88 20.59,5.2 20.59,14.29 23.2,16.9 27.66,16.9 30.13,14.44 30.65,14.44 31.27,15.06 31.93,15.06 32.89,14.1 v37.02,14.1
APDS_IRQ  (via drill 0.39)
  Top 0.203: U1.2 25.85,10.67 26.36,10.16 28.41,10.16 28.59,9.98 v28.59,8.53 | MDBT1.47 42.4,7.81 40.8,9.4 39.24,9.4 39,9.64 v38.98,9.64
  Bottom 0.203: v28.59,8.53 28.59,8.33 28.65,8.27 33.1,8.27 35.12,10.29 38.27,10.29 38.92,9.64 v38.98,9.64
AREF  (via drill 0.39)
  Top 0.203: MDBT1.12 39.59,16.54 39.45,16.68 38.8,16.68 38.09,17.39 38.09,17.98 37.43,18.64 35.09,18.64 34.78,18.34 v34.42,18.34 33.73,17.65 33.44,17.65 C10.2
  Bottom 0.203: v34.42,18.34 33.67,17.59 30.23,17.59 29.27,18.54 22.54,18.54 18.96,14.96 18.96,4.86 16.7,2.6 13.4,2.6 12.06,1.27 MS1.3
CAP1
  Top 0.254: IC3.4 26.98,14.4 26.16,15.22 C12.2
D2
  Top 0.203: MDBT1.54 45.72,7.55 45.72,6.07 46.11,5.68 46.11,2.48 44.9,1.27 MS1.16
D3  (via drill 0.39)
  Top 0.203: MDBT1.4 43.01,16.29 R7.7 43.01,18.21 | 43.01,18.21 42.93,18.28 39.59,18.28 39.16,18.71 39.16,18.96 v39.26,19.06 | 43.01,18.21 R7.2 | v22.1,12.57 22.04,12.57 21.94,12.67 IC1.4
  Bottom 0.203: v22.1,12.57 21.81,12.87 21.81,13.78 23.71,15.68 26.63,15.68 29.14,13.18 36.07,13.18 36.53,12.72 36.53,12.71 36.61,12.63 37.97,12.63 38.35,13.02 38.35,14.73 38.94,15.32 38.94,18.75 v39.26,19.06
D5  (via drill 0.39)
  Top 0.203: MDBT1.25 36.68,11.03 36.87,11.22 40.13,11.22 40.41,11.5 40.41,11.89 41.1,12.58 v41.1,12.62
  Bottom 0.203: v41.1,12.62 41.1,12.74 41.5,13.14 41.5,20.09 40.01,21.59 MS1.19
D6  (via drill 0.39)
  Top 0.203: MDBT1.23 36.49,11.64 39.56,11.64 39.77,11.85 v39.69,11.93
  Bottom 0.203: v39.69,11.93 40.26,11.93 40.39,12.05 40.39,12.88 41.08,13.58 41.08,15.48 41.1,15.49 41.1,19.92 40.62,20.4 38.88,20.4 37.68,21.59 MS1.20
D9  (via drill 0.39)
  Top 0.203: MDBT1.19 36.3,15.34 36.45,15.49 36.45,16.76 36.72,17.03 v36.72,17.5
  Bottom 0.203: MS1.21 34.29,20.6 36.72,18.18 v36.72,17.5
D10  (via drill 0.39)
  Top 0.203: MDBT1.16 35.7,15.43 36,15.72 36,17.19 v35.7,17.49
  Bottom 0.203: v35.7,17.49 35.86,17.65 35.86,18.17 32.84,21.2 32.14,21.2 MS1.22
D11
  Top 0.203: MDBT1.22 34.95,12.23 33.55,13.63 30.3,13.63 28.25,15.67 28.25,21.44 28.47,21.66 29.14,21.66 MS1.23
D12
  Top 0.203: MDBT1.24 35.14,11.68 34.89,11.68 33.35,13.22 30.13,13.22 27.84,15.51 27.84,20.41 MS1.24
D13  (via drill 0.39)
  Top 0.203: MDBT1.26 35.29,10.73 35.16,10.73 34.79,11.1 34.79,11.17 33.14,12.81 29.96,12.81 27.44,15.34 27.44,19.11 24.96,21.59 MS1.25 | R1.1 v5.71,21.72
  Bottom 0.203: v5.71,21.72 6.18,21.72 8.4,19.49 19.41,19.49 20.31,20.4 22.24,20.4 23.43,21.59 MS1.25
D+  (via drill 0.39)
  Top 0.203: X1.D+ 6.07,11.49 6.76,10.8 6.76,10.61 | v6.65,10.72 6.76,10.61 | 6.76,10.61 6.95,10.42 6.95,9.94 7.81,9.08 7.81,4.45 8.91,3.34 24.62,3.34 25.28,4.01 26.79,4.01 28.13,2.67 33.91,2.67 35.37,4.13 R11.1
  Bottom 0.203: v6.65,10.72 5.54,10.72 D+.TP
D-  (via drill 0.39)
  Top 0.203: 6.34,11.94 6.86,11.94 7.35,11.45 7.35,10.11 8.22,9.25 8.22,4.74 9.21,3.75 24.45,3.75 25.11,4.41 27,4.41 28.34,3.07 33.59,3.07 35.03,4.51 R10.1 | v6.67,11.92 6.35,11.92 6.34,11.94 | X1.D- 6.13,12.14 6.34,11.94
  Bottom 0.203: D-.TP 5.54,11.92 v6.67,11.92
DCCH
  Top 0.203: MDBT1.31 33.95,8.23 L1.2
EN  (via drill 0.39)
  Top 0.203: MS1.27 19.05,20.7 17.77,19.43 R12.2 | U2.3 16.89,14.69 v16.89,14.41 | v12.38,20.65 12.64,20.4 v12.64,18.71
  Bottom 0.203: v16.89,14.41 16.57,14.41 14.35,16.64 14.35,17.59 13.27,18.67 12.64,18.67 v12.64,18.71 | v12.38,20.65 12.56,20.65 12.81,20.4 17.86,20.4 MS1.27
GND  (via drill 0.39)
  Top 0.178: D2.C 2.22,17.27 2.22,15.2 X1.SPRT@3
  Top 0.203: U3.2 15.14,11 16.27,12.13 C9.1 16.27,11.54 16.64,11.16 16.64,10.98 17.25,10.38 C5.1 17.72,9.29 C3.1 | MDBT1.2 45.2,15.48 44.83,15.11 44.9,15.05 44.9,8.64 45.25,8.29 45.92,8.29 46.3,7.91 MDBT1.55 | U4.2 22.23,10.92 U4.THERMAL | IC1.1 IC1.2 23.22,14.63 v23.43,14.41 | U5.1 22.12,6.01 21.97,6.16 20.19,6.16 19.56,5.52 19.56,5.4 | 19.56,5.4 | 19.56,5.4 LED1.4
  Top 0.254: U4.7 22.73,10.92 U4.THERMAL v22.48,10.79 | C10.1 32.98,15.79 32.38,16.38 32.38,17.18 IC4.5 | IC4.2 29.92,17.9 IC4.6 | MDBT1.1 45.21,16.08 | 45.21,16.08 MDBT1.2 | D4.C 45.21,17.16 45.21,16.08 | 6.16,22.38 6.12,22.42 5.02,22.42 4.8,22.2 4.8,19.2 3.58,17.98 1.52,17.98 1.37,18.14 1.37,17.37 D2.C
  Top 0.406: R4.2 17.08,5.07 17.41,5.4 LED1.4 | X3.NC1 7.39,21.14 6.16,22.38
  other vias: 11.56,7.49 16.89,8.83 29.21,10.41 19.56,16.57 34.42,15.56 42.99,5.65 34.42,6.67 29.78,7.05 44.7,10.92 44.7,12.57 44.7,14.48 43.31,15.18 43.31,13.84 43.12,12.57 42.93,9.78 43.05,11.3 44.7,8.95 4.89,3.75 7.05,5.33 11.81,5.84 23.11,5.33 24.96,6.92 35.56,20.7 27.05,8.51 28.51,12.51 30.48,20.64 40.39,19.05 26.8,5.14 17.78,13.34 15.56,13.97 10.79,18.54 9.08,21.4 30.35,15.18 13.84,16.13 29.08,4.06 33.85,4.76 32.38,3.81 22.92,19.81 39.05,13.4
  pour Top: 0,0 45.09,0 45.09,22.86 0,22.86
  pour Bottom: 0,0 45.09,0 45.09,22.86 0,22.86
LED2
  Top 0.203: MDBT1.3 44.4,16.89 R7.8
MISO
  Top 0.203: MDBT1.39 38.99,6.59 38.99,2.73 37.53,1.27 MS1.13
MOSI
  Top 0.203: MS1.12 34.04,1.52 35.4,1.52 36.34,2.46 38.15,2.46 38.58,2.9 38.58,6 37.99,6.58 MDBT1.37
N$1
  Top 0.203: R3.1 5.87,5.64 D3.C
N$2
  Top 0.254: U1.3 U1.4
N$3
  Top 0.254: D4.A 44.2,18.78 R7.1
N$5
  Top 0.203: D2.A 4.15,17.27 R1.2
N$11  (via drill 0.39)
  Top 0.203: v6.35,9.53 6.82,9.05 6.82,8.29 R3.2 | v14.48,6.6 14.8,6.92 14.8,8.32 16.09,9.61 U3.1
  Bottom 0.203: v14.48,6.6 14.35,6.73 9.14,6.73 v6.35,9.53
N$12
  Top 0.203: U3.5 15.26,7.02 15.26,6.3 14.47,5.5 R4.1
NEOPIX  (via drill 0.39)
  Top 0.203: MDBT1.38 38.4,7.88 37.97,8.3 v37.97,9.57 | v25.85,6.41 25.85,6.31 24.11,4.57 22.09,4.57 LED1.1
  Bottom 0.203: v37.97,9.57 37.78,9.76 35.19,9.76 33.24,7.81 31.57,7.81 30.04,6.29 25.98,6.29 v25.85,6.41
NFC2  (via drill 0.39)
  Top 0.203: MDBT1.52 44.8,7.84 43.92,8.72 43.92,9.94 v43.94,9.97
  Bottom 0.203: TP1.TP v43.94,9.97
PDM_CLK
  Top 0.178: IC4.3 29.63,16.85 29.02,16.24 29.02,15.68
  Top 0.203: MDBT1.18 34.56,13.83 33.95,14.44 32.47,14.44 31.85,15.06 31.27,15.06 30.63,14.41 30.1,14.41 29.02,15.49 29.02,15.68
PDM_DAT
  Top 0.178: IC4.4 31.17,16.59 31.71,16.59 31.94,16.36 31.94,15.58
  Top 0.203: MDBT1.17 34.38,14.63 34.09,14.92 32.59,14.92 31.94,15.58
QSPI_CS
  Top 0.203: MDBT1.44 40.96,6.54 40.96,4.57 41.33,4.2 IC2.1
QSPI_DATA0
  Top 0.203: MDBT1.41 39.59,5.73 IC2.5
QSPI_DATA1
  Top 0.203: MDBT1.46 41.99,6.62 41.37,6 41.37,4.87 41.53,4.7 IC2.2
QSPI_DATA2  (via drill 0.39)
  Top 0.203: MDBT1.45 41.59,7.81 40.82,8.58 v40.01,8.58 | v42.95,4.32 42.95,4.64 42.38,5.2 IC2.3
  Bottom 0.203: v40.01,8.58 41.27,7.31 41.27,5.14 42.1,4.32 v42.95,4.32
QSPI_DATA3
  Top 0.203: MDBT1.43 40.8,7.31 40.55,7.07 40.55,5.12 40.14,4.7 IC2.7
QSPI_SCK
  Top 0.203: MDBT1.42 39.99,7.31 40.15,7.16 40.15,5.36 39.99,5.2 IC2.6
RESET  (via drill 0.39)
  Top 0.203: MDBT1.40 39.2,8.3 v38.87,8.62 | SW1.B' 9.23,5.04 v10.79,5.04 12.97,5.04 SW1.B 13.07,4.83 13.75,4.15 24.27,4.15 24.94,4.83 25.35,4.83 v25.83,5.31
  Bottom 0.203: MS1.1 10.12,5.04 v10.79,5.04 | v38.87,8.62 38.68,8.82 37.73,8.82 37.19,9.36 35.42,9.36 33.45,7.39 31.72,7.39 30.21,5.88 26.38,5.88 25.83,5.33 v25.83,5.31
RXD
  Top 0.203: MS1.14 40.56,2.46 42.27,2.46 43.72,3.91 43.72,5.94 43.47,6.19 43.47,6.47 43.15,6.78 MDBT1.48
SCK  (via drill 0.39)
  Top 0.203: MDBT1.36 37.53,7.75 v36.32,7.75
  Bottom 0.203: v36.32,7.75 34.48,7.75 33.72,6.99 32.07,6.99 30.1,5.02 30.1,3.37 31.75,1.71 MS1.11
SCL  (via drill 0.39)
  Top 0.203: MDBT1.27 36.55,10.23 37.12,10.8 40.28,10.8 v41.09,11.61 | v25.97,8.54 25.85,8.66 U1.7 | v27.62,12.06 27.04,12.65 IC3.1 | R7.4 41.31,19.66 41.91,20.26 MS1.18 | U5.4 22.47,8.55 v22.68,8.76 22.36,8.76 21.33,9.79 U4.4 21.01,9.92 20.74,10.19 20.74,15.54 21.36,16.15 22.58,16.15 23.1,15.63 IC1.13
  Bottom 0.203: MS1.18 41.91,12.43 v41.09,11.61 40.65,11.16 33.89,11.16 33.64,10.91 30.54,10.91 29.67,11.78 27.65,11.78 27.62,11.81 v27.62,12.06 27.62,12.26 27.28,12.6 26.18,12.6 24.89,11.31 24.89,9.62 v25.97,8.54 25.97,8.26 25.53,7.81 23.19,7.81 22.68,8.32 v22.68,8.76
SDA  (via drill 0.39)
  Top 0.203: MDBT1.29 36.55,9.43 37.5,10.38 40.99,10.38 41.15,10.54 v41.08,10.6 | U5.3 22.93,7.31 23.25,7.63 23.25,8.28 23.73,8.75 v23.68,8.79 | R7.3 42.21,19.48 44.32,21.59 MS1.17 | 21.79,11.84 23.24,11.84 v23.58,12.18 23.83,12.18 24.85,11.16 24.85,11.05 | 21.79,11.84 21.37,11.42 U4.1 | IC1.14 22.14,15.75 21.53,15.75 21.27,15.49 21.27,12.35 21.79,11.84 | 24.85,11.05 U1.1 | v26.41,11.82 25.62,11.82 24.85,11.05
  Top 0.254: IC3.11 25.98,12.25 v26.41,11.82
  Bottom 0.203: MS1.17 42.42,19.56 42.42,11.94 v41.08,10.6 41.08,10.64 40.97,10.76 34.06,10.76 33.8,10.5 30.37,10.5 29.64,11.23 27.44,11.23 26.85,11.82 v26.41,11.82 | v23.58,12.18 23.95,11.81 23.95,9.06 v23.68,8.79
SWCLK  (via drill 0.39)
  Top 0.203: MDBT1.53 45.2,6.02 45.7,5.51 45.7,4.15 v44.89,3.34
  Bottom 0.203: v44.89,3.34 44.19,4.04 44.19,5.53 41.91,7.81 41.43,7.81 40.77,8.47 40.74,8.47 40.74,9.23 SWC.TP
SWDIO  (via drill 0.39)
  Top 0.203: MDBT1.51 44.65,6.53 44.65,5.96 44.96,5.65 v44.96,4.57
  Bottom 0.203: v44.96,4.57 44.96,5.34 41.81,8.49 SWD.TP
SWITCH  (via drill 0.39)
  Top 0.203: v30.8,4.45 31.57,4.45 SW2.B 31.67,5.02 28.2,5.02 SW2.B' | v43.12,8.64 43.23,8.64 43.99,7.87 MDBT1.50
  Bottom 0.203: v30.8,4.45 30.8,3.94 32.19,2.54 45.34,2.54 45.79,2.99 45.79,5.12 45.34,5.57 45.34,5.71 43.12,7.94 v43.12,8.64
TXD
  Top 0.203: MS1.15 41.91,1.52 44.2,3.81 44.2,6.03 43.87,6.36 43.87,6.63 43.2,7.31 MDBT1.49
USBD+
  Top 0.203: R11.2 37.68,6.1 37.2,6.58 MDBT1.35
USBD-
  Top 0.203: MDBT1.34 36.4,5.4 R10.2
VBAT  (via drill 0.39)
  Top 0.305: 14.37,13.76 v14.35,13.78
  Top 0.406: U3.3 14.19,12.08 C9.2 14.37,13.76 | Q3.3 9.85,10.55 10.92,11.62 10.92,13.46 11.62,14.16 11.79,14.34 X3.2 11.89,15.67 v12.99,16.76 13.11,16.89 13.11,18.06 13.6,18.54 15.88,18.54 R12.4 16.07,21.15 MS1.28
  Bottom 0.406: v14.35,13.78 12.99,15.14 v12.99,16.76
VBUS  (via drill 0.39)
  Top 0.203: MDBT1.32 32.77,7.43 32.58,7.62 31.3,7.62 31.3,12.26 | 22.36,21.52 21.59,21.52
  Top 0.254: D1.A 7.9,12.39 7.5,12.79 | X1.VBUS 4.86,12.79 4.74,12.67 4.03,12.67 3.37,13.34 1.52,13.34 0.99,12.8 0.99,9.34 0.76,9.11 0.76,5.91 D3.A | 21.59,21.52 MS1.26 | C6.2 20.38,18.16 20.38,18.73 20.38,20.51 | 22.36,21.52 23.56,20.32 25.53,20.32 27.01,18.84 27.01,15.11 29.73,12.38 31.18,12.38 31.3,12.26
  Top 0.406: 7.5,12.79 X1.VBUS | 20.38,18.73 19.05,18.73 R12.1 | U3.4 14.19,9.14 v14.29,9.14 | v9.02,20.19 9.02,18.29 8.38,17.65 8.38,12.43 | Q3.1 8.8,8.61 8.8,9.5 8.32,9.99 v8.32,10.99 8.32,12.49 8.38,12.43 | D1.A 8.38,12.43 | MS1.26 21.46,21.59 20.38,20.51
  Bottom 0.254: v9.02,20.19 9.28,19.93 19.16,19.93 20.83,21.59 MS1.26
  Bottom 0.406: v14.29,9.14 14.29,9.08 12.57,10.79 8.51,10.79 v8.32,10.99
VDIV  (via drill 0.39)
  Top 0.203: v33.47,18.67 33.47,18.74 33.77,19.05 37.6,19.05 38.5,18.15 38.5,17.56 38.97,17.09 39.7,17.09 40.4,16.4 MDBT1.10 | R12.6 R12.5 15.48,16.65 v15.11,17.02
  Bottom 0.203: v15.11,17.02 18.67,17.02 20.6,18.95 29.44,18.95 30.33,18.06 32.58,18.06 33.19,18.67 v33.47,18.67
VHI
  Top 0.406: 12.18,10.91 12.11,10.99 D1.C 12.83,13.11 12.83,14.29 13.78,15.24 16.82,15.24 17.71,16.14 | 12.18,10.91 C7.2 | Q3.2 10.77,9.5 12.18,10.91 | R12.7 17.77,16.2 17.71,16.14 | U2.1 19.73,15.26 19.24,15.75 18.1,15.75 17.71,16.14